# EAGLE design power-switching-TPS6211x (EAGLE 9.2.2)
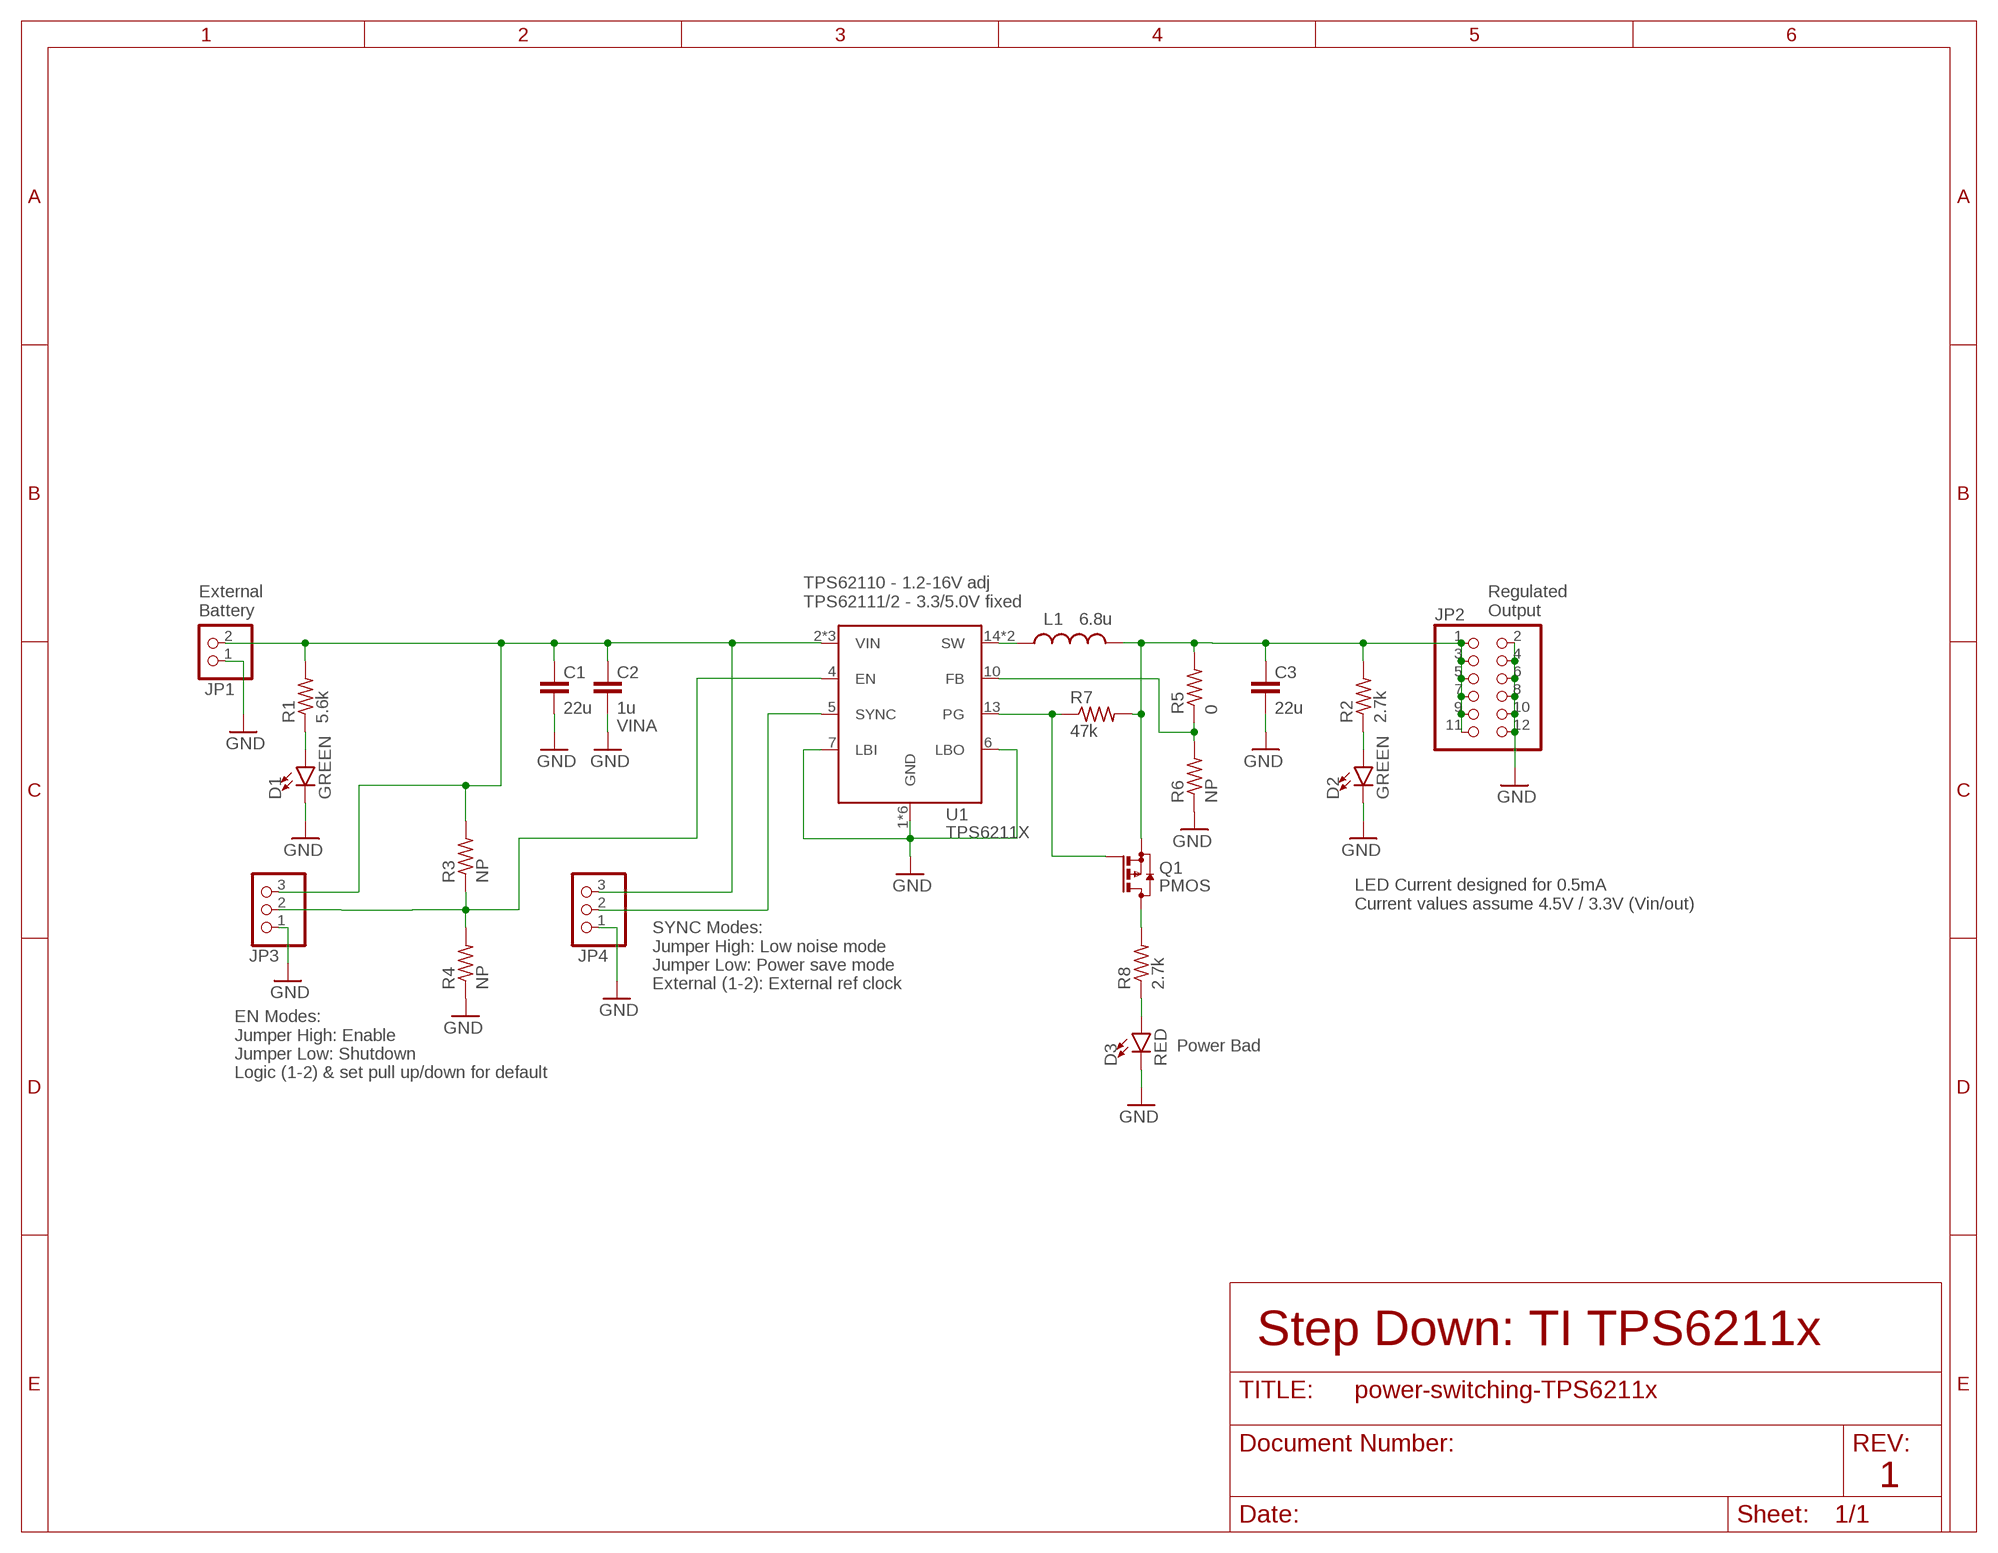
[diagram p0: schematic, sheet 1]

## Parts
C1  22u  C-EU1206-B  [1206-B]
C2  1u  C-EU0603-B-NOSILK  [.0603-B-NOSILK]
C3  22u  C-EU1206-B  [1206-B]
D1  GREEN  LED-GREEN0603  [LED-0603]
D2  GREEN  LED-GREEN0603  [LED-0603]
D3  RED  LED-GREEN0603  [LED-0603]
JP1  PINHD-1X2  [1X02]
JP2  PINHD-2X6  [2X06]
JP3  PINHD-1X3  [1X03]
JP4  PINHD-1X3  [1X03]
L1  6.8u  L-ECS-MPI4040  [ECS-MPI4040]
Q1  PMOS  BSS84  [SOT23]
R1  5.6k  R-US_0603-B-NOSILK  [.0603-B-NOSILK]
R2  2.7k  R-US_0603-B-NOSILK  [.0603-B-NOSILK]
R3  NP  R-US_0402-B-NOSILK  [.0402-B-NOSILK]
R4  NP  R-US_0402-B-NOSILK  [.0402-B-NOSILK]
R5  0  R-US_0402-B-NOSILK  [.0402-B-NOSILK]
R6  NP  R-US_0402-B-NOSILK  [.0402-B-NOSILK]
R7  47k  R-US_0402-B-NOSILK  [.0402-B-NOSILK]
R8  2.7k  R-US_0603-B-NOSILK  [.0603-B-NOSILK]
U1  TPS6211X  [S-PVQFN-16]

## Nets
+VIN: C1.1 C2.1 JP1.2 JP3.3 JP4.3 R1.2 R3.2 U1.2(VIN) U1.3(VIN) U1.8(VIN)
+VOUT: C3.1 JP2.1 JP2.3 JP2.5 JP2.7 JP2.9 JP2.11 L1.2 Q1.2(S) R2.2 R5.2 R7.2
+VOUT1: Q1.3(D) R8.2
EN: JP3.2 R3.1 R4.2 U1.4(EN)
FB: R5.1 R6.2 U1.10(FB)
GND: C1.2 C2.2 C3.2 D1.C D2.C D3.C JP1.1 JP2.2 JP2.4 JP2.6 JP2.8 JP2.10 JP2.12 JP3.1 JP4.1 R4.1 R6.1 U1.1(GND) U1.6(LBO) U1.7(LBI) U1.9(GND) U1.11(GND) U1.12(GND) U1.16(GND) U1.PAD(GND)
N$3: D3.A R8.1
N$6: D1.A R1.1
N$271: D2.A R2.1
PG: Q1.1(G) R7.1 U1.13(PG)
SW: L1.1 U1.14(SW) U1.15(SW)
SYNC: JP4.2 U1.5(SYNC)

## Notes on the sheet
- TPS62110 - 1.2-16V adj
  TPS62111/2 - 3.3/5.0V fixed
- External
  Battery
- Regulated
  Output
- VINA
- LED Current designed for 0.5mA
  Current values assume 4.5V / 3.3V (Vin/out)
- SYNC Modes:
  Jumper High: Low noise mode
  Jumper Low: Power save mode
  External (1-2): External ref clock
- Power Bad
- EN Modes:
  Jumper High: Enable
  Jumper Low: Shutdown
  Logic (1-2) & set pull up/down for default
- Step Down: TI TPS6211x
- 1

## Library data of the parts
C1-C3 = oresat-rcl:C-EU: CAPACITOR, European symbol
D1 D2 = SparkFun-LED:LED-GREEN: Green SMD LED Used in manufacturing of various products at SparkFun Packages: 0603 - SMD 0603 package [Product Link] <http://www.futureelectronics.com/en/technologies/semiconductors/optoelectronics/leds/Pages/9894312-LTST-C190GKT.aspx?CrossPart=HSMG-C190&IM=0> LilyPad 1206 - SMD1206 LilyPad package [Product Link] <http://www.futureelectronics.com/en/Technologies/Product.aspx?ProductID=IN150NGHARVATEKCORPORATION2049943&IM=0> 1206 - SMD1206 package [Product Link] <http://www.futureelectronics.com/en/technologies/semiconductors/optoelectronics/leds/Pages/8315665-LTST-C150KGKT.aspx?IM=0> 1206 Bottom Mount -SMD 1206 Bottom Mount [Product Link] <http://www.digikey.com/product-detail/en/lite-on-inc/LTST-C230KGKT/160-1456-1-ND/386854> SparkFun Products: Pro Mini 328 -5V <https://www.sparkfun.com/products/821> RedBoard <https://www.sparkfun.com/products/12757> MP3 Trigger <https://www.sparkfun.com/products/13720> Makey Makey <https://www.sparkfun.com/products/11076>
D3 = SparkFun-LED:LED-GREEN: Green SMD LED Used in manufacturing of various products at SparkFun Packages: 0603 - SMD 0603 package [Product Link] <http://www.futureelectronics.com/en/technologies/semiconductors/optoelectronics/leds/Pages/9894312-LTST-C190GKT.aspx?CrossPart=HSMG-C190&IM=0> LilyPad 1206 - SMD1206 LilyPad package [Product Link] <http://www.futureelectronics.com/en/Technologies/Product.aspx?ProductID=IN150NGHARVATEKCORPORATION2049943&IM=0> 1206 - SMD1206 package [Product Link] <http://www.futureelectronics.com/en/technologies/semiconductors/optoelectronics/leds/Pages/8315665-LTST-C150KGKT.aspx?IM=0> 1206 Bottom Mount -SMD 1206 Bottom Mount [Product Link] <http://www.digikey.com/product-detail/en/lite-on-inc/LTST-C230KGKT/160-1456-1-ND/386854> SparkFun Products: Pro Mini 328 -5V <https://www.sparkfun.com/products/821> RedBoard <https://www.sparkfun.com/products/12757> MP3 Trigger <https://www.sparkfun.com/products/13720> Makey Makey <https://www.sparkfun.com/products/11076>; VALUE: GREEN
JP1 = pinhead:PINHD-1X2: PIN HEADER
JP2 = pinhead:PINHD-2X6: PIN HEADER
JP3 JP4 = pinhead:PINHD-1X3: PIN HEADER
L1 = L-ECS-MPI4040:L-ECS-MPI4040; MFR: ECS; MPN: ECS-MPI4040R4-6R8-R
Q1 = transistor-small-signal:BSS84: P-CHANNEL MOS FET
R1-R8 = oresat-rcl:R-US_: RESISTOR, American symbol
U1 = U-TI-TPS6211x-SPS-buck:TPS6211X: TPS6211x 17-V, 1.5-A, Synchronous Step-Down Converter

## Board
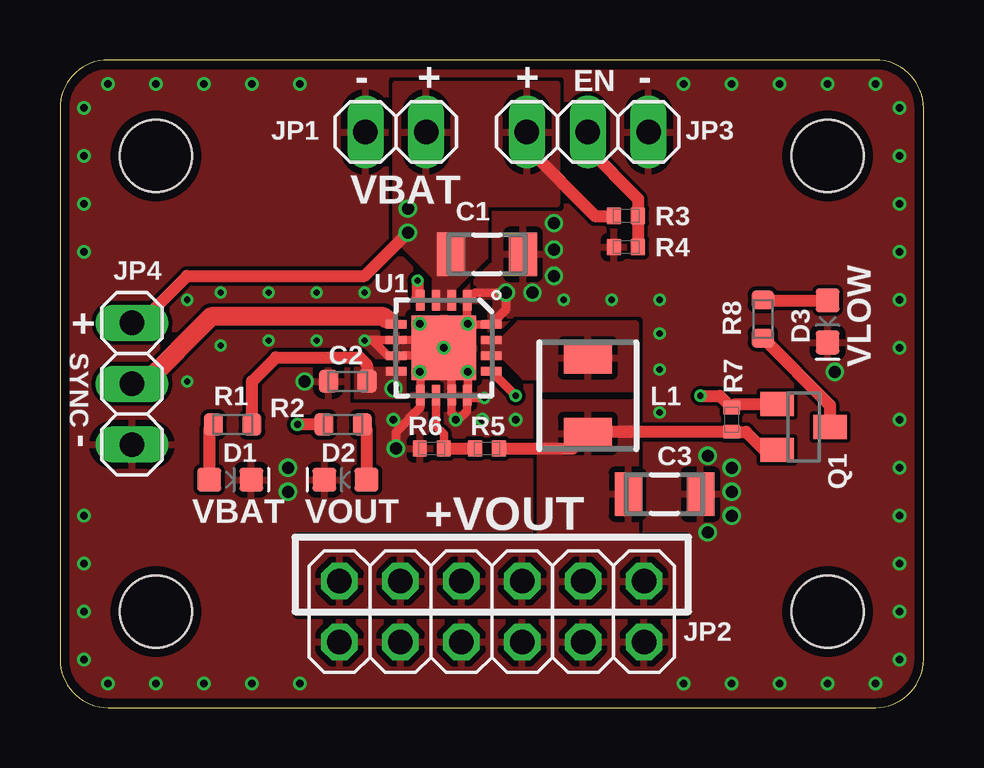
[diagram p1: board, top side]
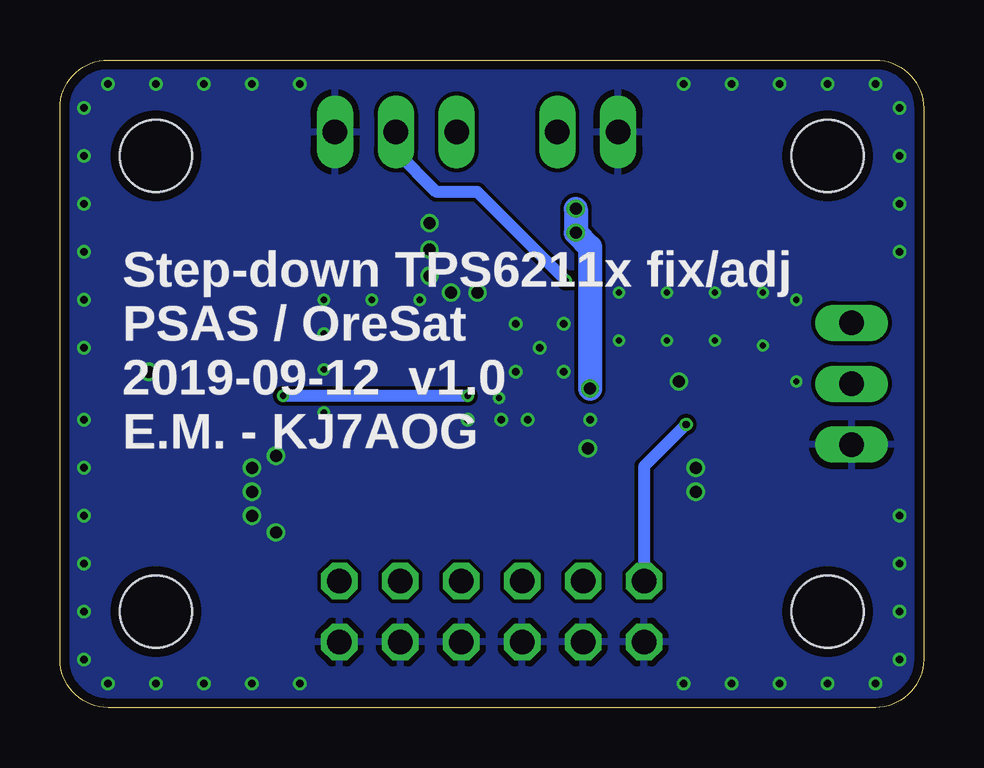
[diagram p2: board, bottom side, seen from below]

Size 36 x 27 mm. Coordinates in mm from the lower left corner, seen from the top.
Outline: 0,25 0,2 arc90 2,0 34,0 arc90 36,2 36,25 arc90 34,27 2,27 arc90 0,25
Copper layers (1*16): Top 0.035559375mm / dielectric 1.6mm / Bottom 0.035559375mm
Design rules "oshpark-2layer-tented": minimum track width 6mil, minimum drill 10mil, track to track 6mil, track to pad 6mil, pad to pad 6mil, via to via 6mil, smd to smd 6mil, copper to edge 15mil, drill to drill 6mil, minimum pad ring 5mil, minimum via ring 5mil, stop-mask expansion 2.5mil, vias tented up to drill 20mil, thermal gap 10mil
Holes 3 mm at 4,4 32,4 4,23 32,23

### Footprints (pad centres in the part's own frame; a part is rotated, then mirrored left to right if it is on the bottom)
1206-B = smd 1.15 x 1.8: 1 -1.5,0; 2 1.5,0
.0603-B-NOSILK = smd 0.8 x 0.95: 1 -0.8,0; 2 0.8,0
LED-0603 = smd 1 x 1: A -0.877,0; C 0.877,0
1X02 = drill 1.016 long: 1 -1.27,0; 2 1.27,0
2X06 = drill 1.016 octagon: 1 -6.35,-1.27; 2 -6.35,1.27; 3 -3.81,-1.27; 4 -3.81,1.27; 5 -1.27,-1.27; 6 -1.27,1.27; 7 1.27,-1.27; 8 1.27,1.27; 9 3.81,-1.27; 10 3.81,1.27; 11 6.35,-1.27; 12 6.35,1.27
1X03 = drill 1.016 long: 1 -2.54,0; 2 0,0; 3 2.54,0
ECS-MPI4040 = smd 2 x 1.3: 1 0,1.575; 2 0,-1.575
SOT23 = smd 1 x 1.4: 1 -0.95,-1.1; 2 0.95,-1.1; 3 0,1.1
.0402-B-NOSILK = smd 0.6 x 0.7: 1 -0.5,0; 2 0.5,0
S-PVQFN-16 = smd 0.85 x 0.35: 1 -1.975,0.975; 2 -1.975,0.325; 3 -1.975,-0.325; 4 -1.975,-0.975; 9 1.975,-0.975; 10 1.975,-0.325; 11 1.975,0.325; 12 1.975,0.975 | smd 0.35 x 0.85: 5 -0.975,-1.975; 6 -0.325,-1.975; 7 0.325,-1.975; 8 0.975,-1.975; 13 0.975,1.975; 14 0.325,1.975; 15 -0.325,1.975; 16 -0.975,1.975 | smd 2.7 x 2.7: PAD 0,0

### Placement (x,y rotation side)
C1  17.8,18.9 0 top
C2  12,13.6 180 top
C3  25.2,8.9 0 top
D1  7.1,9.5 0 top
D2  11.9,9.5 180 top
D3  32,16.1 270 top
JP1  14,24 0 top
JP2  18,4 180 top
JP3  22,24 180 top
JP4  3,13.5 90 top
L1  22,13 0 top
Q1  31,11.7 270 top
R1  7.2,11.8 0 top
R2  11.8,11.8 180 top
R3  23.6,20.5 180 top
R4  23.6,19.2 0 top
R5  17.8,10.8 0 top
R6  15.5,10.8 0 top
R7  28,12 270 top
R8  29.3,16.2 270 top
U1  16,15 270 top

### Tracks (layer width: path | path; a pad name or v marks a point on that pad's centre or on a via)
+VIN  (via drill 0.5)
  Top 0.5: JP4.3 3.04,16 3.3,16 5.3,18 12.7,18 v14.5,19.8 | R1.2 8,13.6 9,14.6 12.5,14.6 12.8,14.3 C2.1 | JP3.3 19.46,23.34 22.3,20.5 R3.2
  Bottom 1: v14.5,20.8 v14.5,19.8 13.9,19.2 v13.9,13.3
  pour Top (no thermals): 15.55,16.6 16.45,16.6 16.45,17.4 17.8,18.75 17.8,22 13.9,22 13.9,19.55 15.55,17.9
  pour Top (no thermals): 14.4,14.15 12.3,14.15 12.3,12.9 14.4,12.9
  pour Top: 14,26 20.7,26 20.7,21 14,21
+VOUT  (via drill 0.3)
  Top 0.5: 23.6,9 C3.1 | R5.2 21.38,10.8 L1.2 22.07,11.5 R7.2 28.6,11.5 29.35,10.75 Q1.2 | R2.2 v9.9,11.8
  Bottom 0.5: v9.9,11.8 11.65,10.05 JP2.11
  pour Top: 10,7 10,4 26,4 26,7
  pour Top: 24,6 24,12.7 20,12.7 20,6
+VOUT1
  Top 0.5: R8.2 32.1,12.6 Q1.3
EN  (via drill 0.25)
  Top 0.35: 14.9,17.1 U1.4
  Top 0.5: v14.9,17.8 14.9,17.1 | R4.2 R3.1 24.1,21.2 22,23.3 JP3.2
  Bottom 0.5: v14.9,17.8 18.6,21.5 20.3,21.5 22,23.2 JP3.2
FB
  Top 0.35: U1.10 15.68,11.72 16,11.4 R6.2
  Top 0.5: R6.2 16.6,10.8 R5.1
GND  (via drill 0.25, 0.3, 0.5)
  Top 0.35: 16.98,15.97 U1.1 17.3,17.3 v18.6,17.3 18.6,16.6 U1.16 16.98,15.97 | 16.98,15.97 v17,16 16.98,15.97 | v15,14 15.03,13.97 U1.9 15.03,12.53 14,11.5 v14,10.8 | U1.12 17.1,12.9 v17.7,12.9 | U1.11 16.32,12.97 | 13,15.32 U1.6 15.68,15.32 U1.PAD 15.68,14.68 U1.7 13.65,14.68 13,15.32 | 13,15.32 12.72,15.32 v12.7,15.3 | U1.11 16.32,12.28 16.6,12 16.98,12.38 U1.12 | U1.12 17,13.05 v17,14 16.3,14 16.32,13.97 U1.11
  other vias: 15,16 1,25 1,23 1,21 1,19 1,2 1,4 1,6 1,8 2,1 4,1 6,1 8,1 10,1 34,1 35,2 32,1 30,1 28,1 26,1 35,4 35,6 35,8 35,10 35,25 34,26 35,23 35,21 35,19 35,17 32,26 30,26 28,26 26,26 2,26 4,26 6,26 8,26 10,26 10.2,13.6 9.5,10 9.5,9 28,10 28,9 28,8 27,10.5 27,7.3 20.6,20.2 20.6,19.1 20.6,18 19.7,17.3 12.7,17.3 10.7,17.3 8.7,17.3 6.7,17.3 10.7,15.3 8.7,15.3 6.7,15.1 5.3,17 5.3,13.6 21,17 23,17 25,17 25,15.6 25,14.1 25,12.3 16,15 35,15 35,12 32.3,14 16.5,12 17.6,12 19,12 13.9,12
  pour Top (rank 2): 0,27 0,0 36,0 36,27
  pour Bottom (rank 2): 0,27 0,0 36,0 36,27
N$3
  Top 0.5: R8.1 29.32,16.98 D3.A
N$6
  Top 0.5: R1.1 6.22,11.62 D1.A
N$271
  Top 0.5: R2.1 12.78,11.62 D2.A
PG  (via drill 0.25)
  Top 0.35: U1.13 v19,13
  Top 0.5: v26.7,13 27.5,13 R7.1 28.15,12.65 Q1.1
  Bottom 0.5: v19,13 v26.7,13
SW
  pour Top: 20,13.3 24,13.3 24,16 20,16
  pour Top (no thermals): 17.6,15.45 17.6,14.55 18.45,14.55 19.3,13.7 20,13.7 20,16.1 19.1,16.1 18.45,15.45
SYNC
  Top 0.35: 13.6,16.2 13.8,16.2 U1.5
  Top 0.8: JP4.2 3.5,13.5 6.3,16.3 13.5,16.3 13.6,16.2

### Text on the board
tPlace: - | + | + | EN | - | VBAT | + | SYNC | VLOW | - | VBAT | VOUT | +VOUT
bPlace: Step-down TPS6211x fix/adj / PSAS / OreSat / 2019-09-12 v1.0 / E.M. - KJ7AOG